# EasyEDA schematic Atmega328p Custom Board.json
TITLE: Sheet_1; REV: 1.0; Date: 2023-10-20; Sheet: 1/1; Drawn By: shakur_siam; Company: Your Company
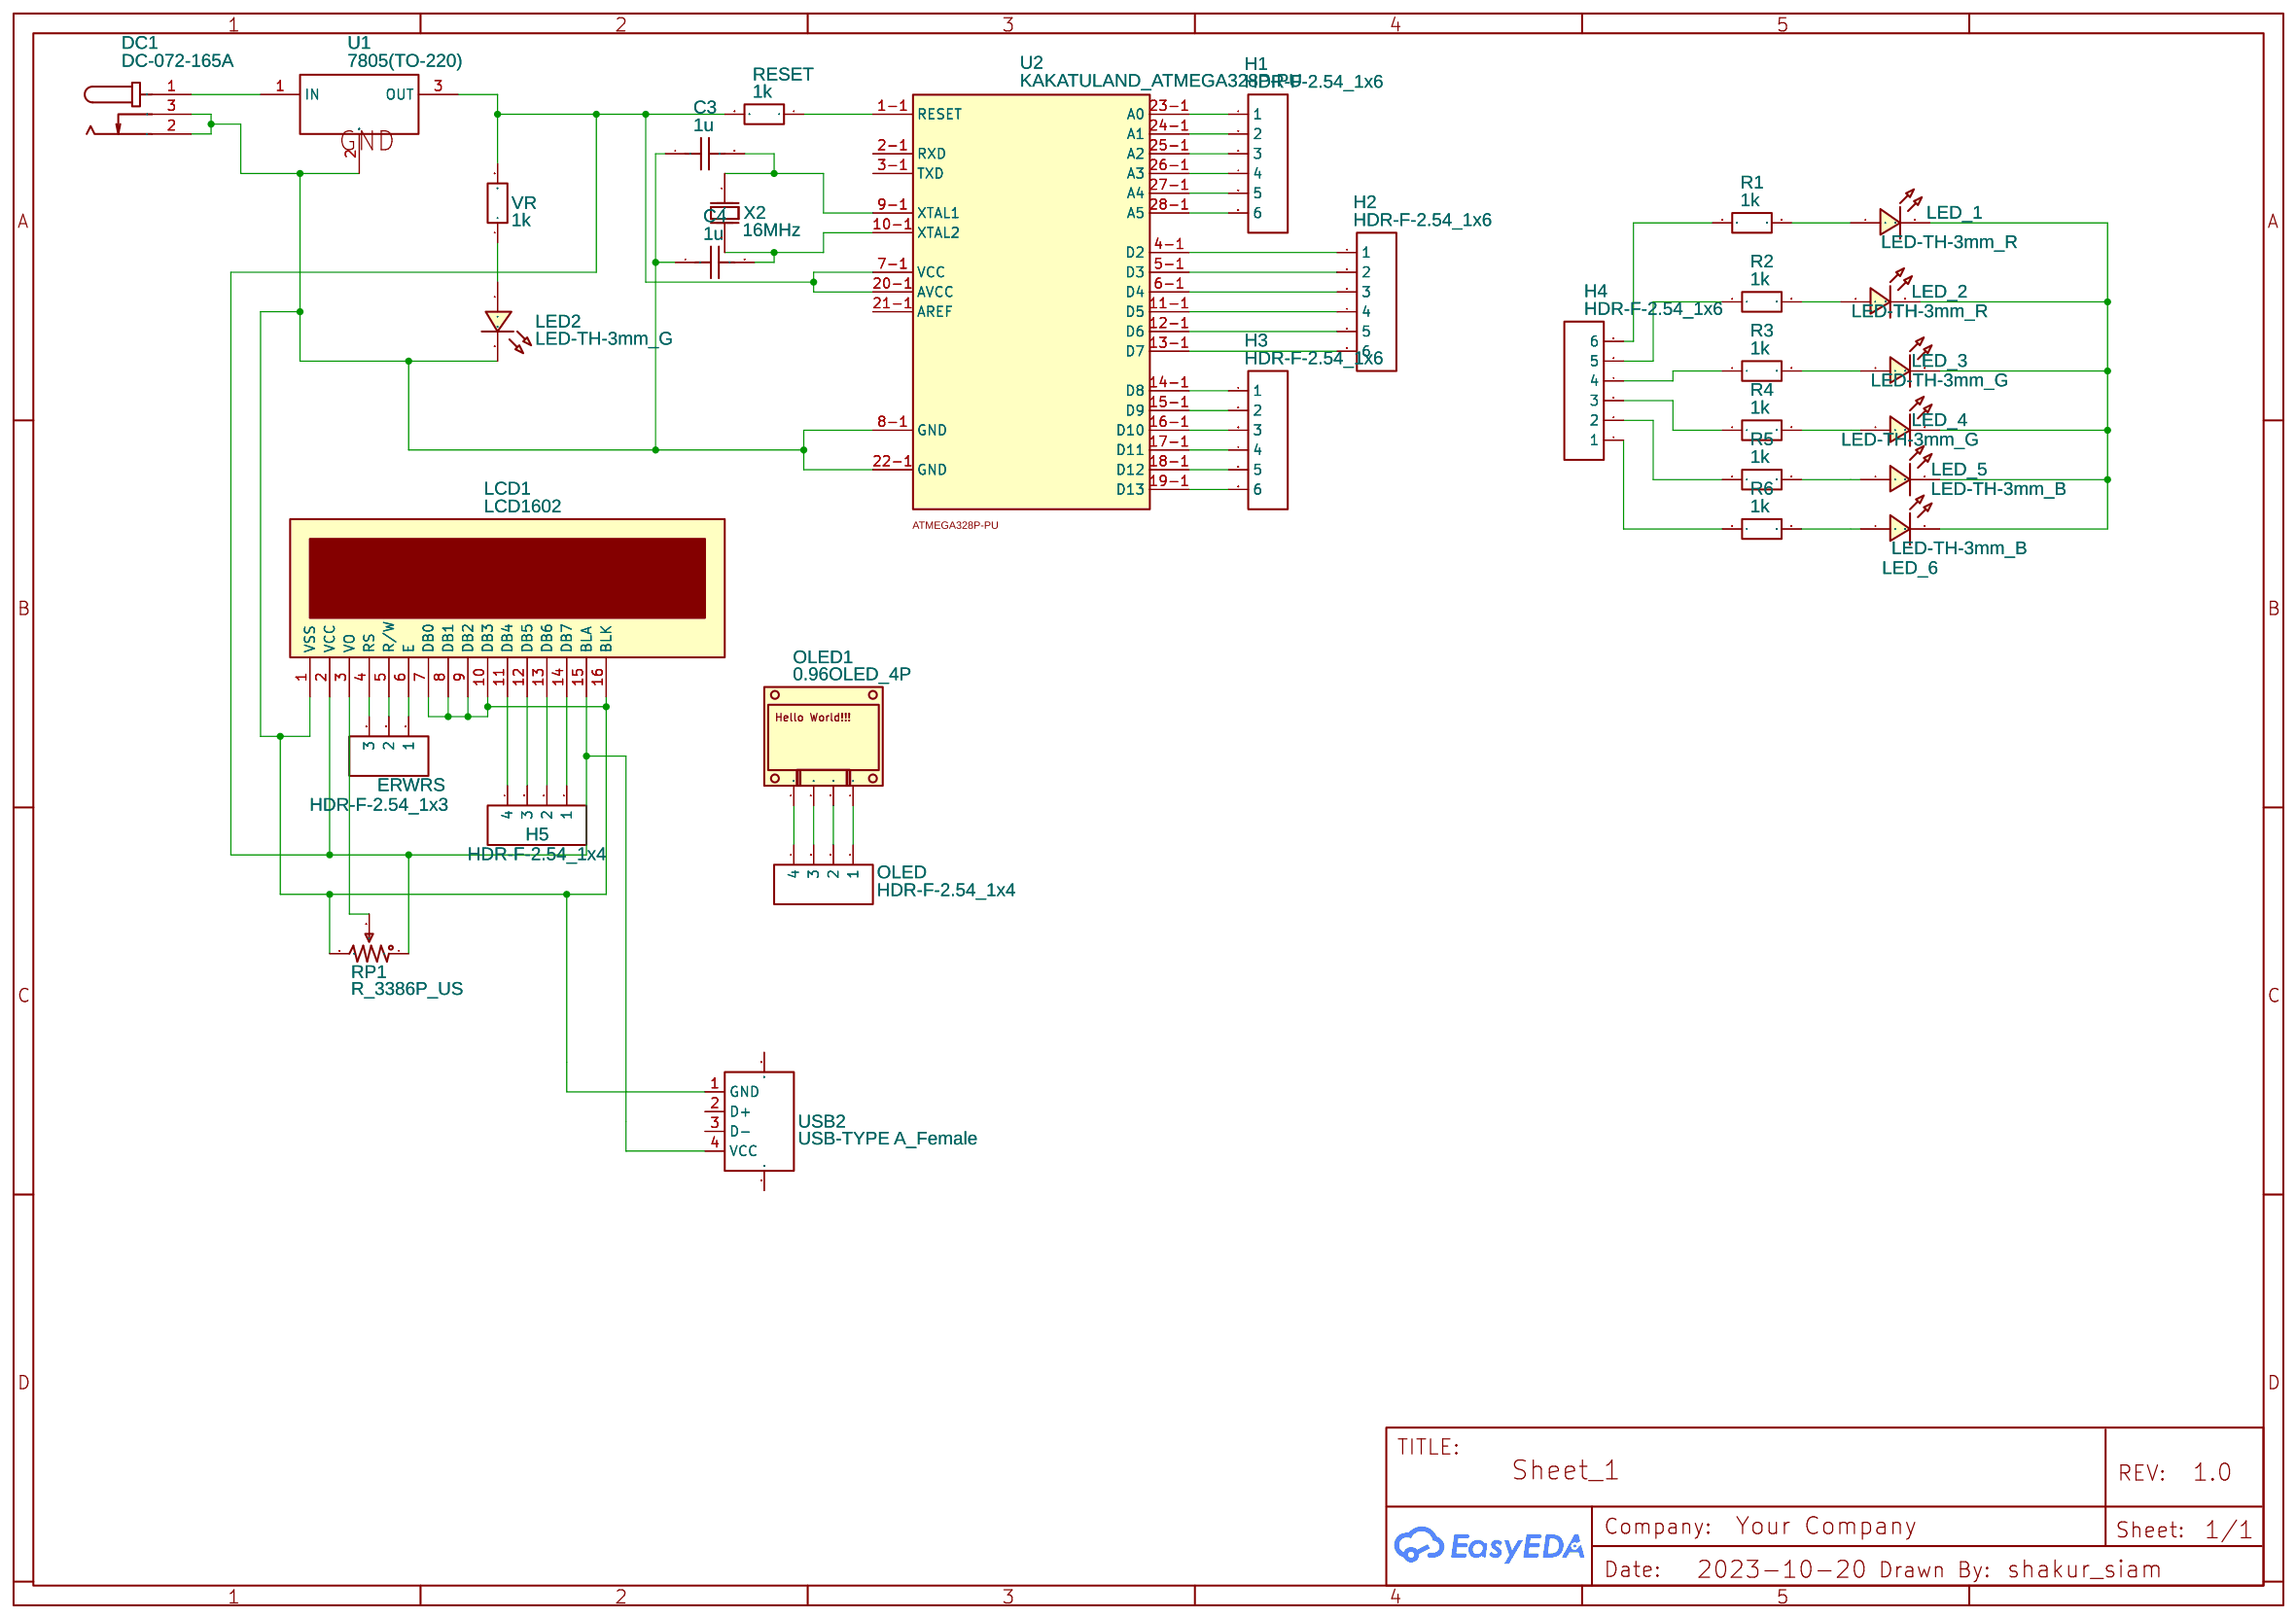
[diagram p0: schematic sheet]

## Parts
C3  1u  [RAD-0.2]
C4  1u  [RAD-0.2]
DC1  DC-072-165A  [DC-IN-TH_DC-072-165A]
ERWRS  HDR-F-2.54_1x3  [HDR-F-2.54_1X3]
H1  HDR-F-2.54_1x6  [HDR-F-2.54_1X6]
H2  HDR-F-2.54_1x6  [HDR-F-2.54_1X6]
H3  HDR-F-2.54_1x6  [HDR-F-2.54_1X6]
H4  HDR-F-2.54_1x6  [HDR-F-2.54_1X6]
H5  HDR-F-2.54_1x4  [HDR-F-2.54_1X4]
LCD1  LCD1602  [LCD1602]
LED2  LED-TH-3mm_G  [LED-TH_BD3.0_GREEN]
LED_1  LED-TH-3mm_R  [LED-TH_BD3.0_RED]
LED_2  LED-TH-3mm_R  [LED-TH_BD3.0_RED]
LED_3  LED-TH-3mm_G  [LED-TH_BD3.0_GREEN]
LED_4  LED-TH-3mm_G  [LED-TH_BD3.0_GREEN]
LED_5  LED-TH-3mm_B  [LED-TH_BD3.0_BLUE]
LED_6  LED-TH-3mm_B  [LED-TH_BD3.0_BLUE]
OLED  HDR-F-2.54_1x4  [HDR-F-2.54_1X4]
OLED1  0.96OLED_4P  [0.96OLED_4P]
R1  1k  [R0603]
R2  1k  [R0603]
R3  1k  [R0603]
R4  1k  [R0603]
R5  1k  [R0603]
R6  1k  [R0603]
RESET  1k  [R0603]
RP1  R_3386P_US  [RES-ADJ-TH_3386P]
U1  7805(TO-220)  [TO-220-3_L10.0-W4.5-P2.54-L]
U2  KAKATULAND_ATMEGA328P-PU  [KAKATULAND_ATMEGA328P-PU]
USB2  USB-TYPE A_Female  [USB-A-SMD_USB-M-32]
VR  1k  [R0603]
X2  16MHz  [GM-CRYSTAL-16MHZ]

## Library data of the parts
C3 C4 = C_RAD-0.2_US: Contributor: LCEDA_Lib
DC1 = DC-072-165A: Supplier: LCSC; Manufacturer: HRO; Supplier Part: C129003
ERWRS = HDR-F-2.54_1x3: Supplier Part: C146690; Supplier: LCSC; Contributor: LCEDA_Lib
H1-H4 = HDR-F-2.54_1x6: Supplier Part: C40877; Supplier: LCSC; Contributor: LCEDA_Lib
H5 OLED = HDR-F-2.54_1x4: Supplier Part: C225501; Supplier: LCSC; Contributor: LCEDA_Lib
LCD1 = LCD1602: Manufacturer: LONTECH(厦门龙特); Manufacturer Part: LCM1602K-NSW-BBW; Supplier Part: C83275; Supplier: LCSC; Contributor: LCEDA_Lib
LED2 LED_3 LED_4 = LED-TH-3mm_G: Manufacturer: EVERLIGHT(台湾亿光); Manufacturer Part: 204-10SYGD/S530-E3; Supplier Part: C85161; Contributor: LCEDA_Lib
LED_1 LED_2 = LED-TH-3mm_R: Manufacturer: EVERLIGHT(台湾亿光); Manufacturer Part: 204-10SDRD/S530-A3-L; Supplier Part: C84774; Supplier: LCSC; Contributor: LCEDA_Lib
LED_5 LED_6 = LED-TH-3mm_B: Manufacturer: EVERLIGHT(台湾亿光); Manufacturer Part: 204-10SUBC/S400-A4; Supplier Part: C86881; Supplier: LCSC; Contributor: LCEDA_Lib
OLED1 = 0.96OLED_4P: Supplier: LCSC; Contributor: LCEDA_Lib
R1-R6 RESET VR = R_0603_EU: Contributor: LCEDA_Lib
RP1 = R_3386P_US: Supplier: LCSC; Contributor: LCEDA_Lib; value(Ω): 10K
U1 = 7805(TO-220): Supplier: LCSC; Manufacturer: STMicroelectronics; Manufacturer Part: L7805CV-DG; Supplier Part: C3795; Contributor: LCEDA_Lib
U2 = KAKATULAND_ATMEGA328P-PU: Contributor: kakatuland
USB2 = USB-TYPE A_Female: Supplier Part: C42605; Supplier: LCSC; Manufacturer: ValuePro; Contributor: LCEDA_Lib
X2 = GM-CRYSTAL-16MHz: Contributor: Andres Felipe Rodriguez Sanchez

## Nets
Net-(C3-1): C3.1 C4.1 DC1.2 DC1.3 LCD1.1(VSS) LCD1.7(DB0) LCD1.8(DB1) LCD1.9(DB2) LCD1.10(DB3) LCD1.16(BLK) LED2.2 RP1.3 U1.2(GND) U2.8-1(GND) U2.22-1(GND) USB2.1(GND)
Net-(C3-2): C3.2 U2.9-1(XTAL1) X2.1
Net-(C4-2): C4.2 U2.10-1(XTAL2) X2.2
Net-(DC1-1): DC1.1 U1.1(IN)
Net-(ERWRS-1): ERWRS.1 LCD1.6(E)
Net-(ERWRS-2): ERWRS.2 LCD1.5(R/W)
Net-(ERWRS-3): ERWRS.3 LCD1.4(RS)
Net-(H1-1): H1.1 U2.23-1(A0)
Net-(H1-2): H1.2 U2.24-1(A1)
Net-(H1-3): H1.3 U2.25-1(A2)
Net-(H1-4): H1.4 U2.26-1(A3)
Net-(H1-5): H1.5 U2.27-1(A4)
Net-(H1-6): H1.6 U2.28-1(A5)
Net-(H2-1): H2.1 U2.4-1(D2)
Net-(H2-2): H2.2 U2.5-1(D3)
Net-(H2-3): H2.3 U2.6-1(D4)
Net-(H2-4): H2.4 U2.11-1(D5)
Net-(H2-5): H2.5 U2.12-1(D6)
Net-(H2-6): H2.6 U2.13-1(D7)
Net-(H3-1): H3.1 U2.14-1(D8)
Net-(H3-2): H3.2 U2.15-1(D9)
Net-(H3-3): H3.3 U2.16-1(D10)
Net-(H3-4): H3.4 U2.17-1(D11)
Net-(H3-5): H3.5 U2.18-1(D12)
Net-(H3-6): H3.6 U2.19-1(D13)
Net-(H4-1): H4.1 R6.1
Net-(H4-2): H4.2 R5.1
Net-(H4-3): H4.3 R4.1
Net-(H4-4): H4.4 R3.1
Net-(H4-5): H4.5 R2.1
Net-(H4-6): H4.6 R1.1
Net-(H5-1): H5.1 LCD1.14(DB7)
Net-(H5-2): H5.2 LCD1.13(DB6)
Net-(H5-3): H5.3 LCD1.12(DB5)
Net-(H5-4): H5.4 LCD1.11(DB4)
Net-(LCD1-2): LCD1.2(VCC) LCD1.15(BLA) RESET.2 RP1.1 U1.3(OUT) U2.7-1(VCC) U2.20-1(AVCC) USB2.4(VCC) VR.2
Net-(LCD1-3): LCD1.3(VO) RP1.2
Net-(LED2-1): LED2.1 VR.1
Net-(LED_1-1): LED_1.1 R1.2
Net-(LED_1-2): LED_1.2 LED_2.2 LED_3.2 LED_4.2 LED_5.2 LED_6.2
Net-(LED_2-1): LED_2.1 R2.2
Net-(LED_3-1): LED_3.1 R3.2
Net-(LED_4-1): LED_4.1 R4.2
Net-(LED_5-1): LED_5.1 R5.2
Net-(LED_6-1): LED_6.1 R6.2
Net-(OLED-1): OLED.1 OLED1.4
Net-(OLED-2): OLED.2 OLED1.3
Net-(OLED-3): OLED.3 OLED1.2
Net-(OLED-4): OLED.4 OLED1.1
Net-(RESET-1): RESET.1 U2.1-1(RESET)

Not connected (* = marked no-connect by the designer): U2 2-1(RXD) 3-1(TXD) 21-1(AREF); USB2 2(D+) 3(D-) 5 6
